# Altium schematic sheet CAN.SchDoc: =DocumentName
size A4; Organization: Queen's Formula SAE; Address1: 130 Stuart St, Kingston; Address2: Ontario; Address3: Canada; Address4: K7L 2V9; DocumentNumber: 1; Revision: 0; SheetNumber: 1; SheetTotal: 1
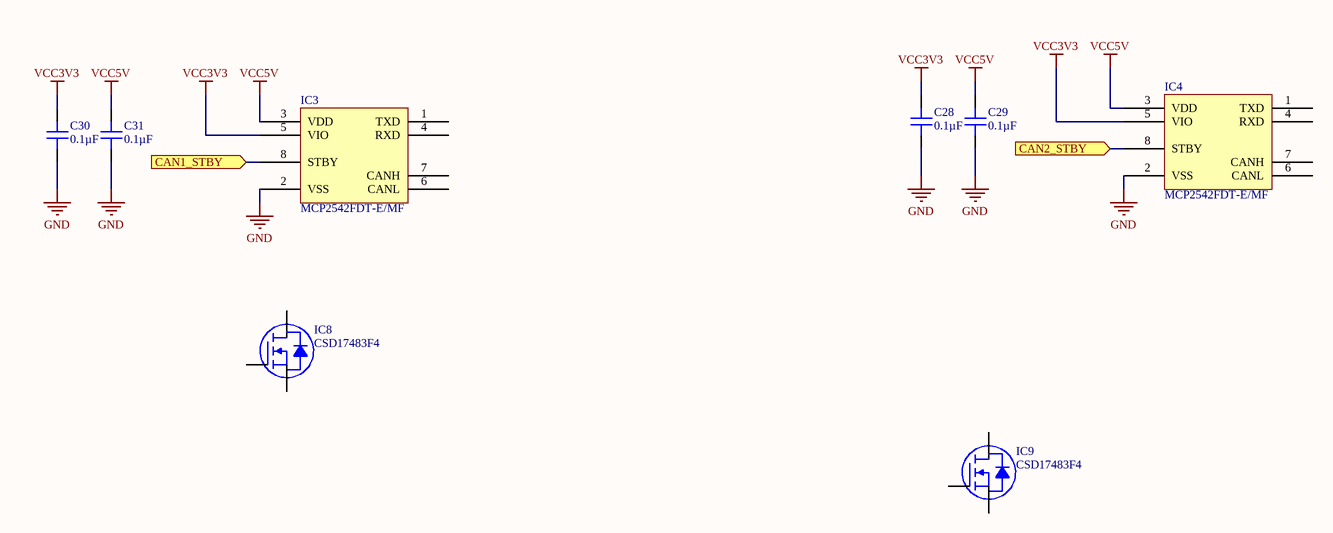
[diagram p0: CAN.SchDoc]

## Parts
C28  0.1µF  [CAP 0201_0603]
C29  0.1µF  [CAP 0201_0603]
C30  0.1µF  [CAP 0201_0603]
C31  0.1µF  [CAP 0201_0603]
IC3  MCP2542FDT-E/MF  [MICROCHIP DFN-8 3X3MM]
IC4  MCP2542FDT-E/MF  [MICROCHIP DFN-8 3X3MM]
IC8  CSD17483F4  [TI 3-XFDFN F4 YJC]
IC9  CSD17483F4  [TI 3-XFDFN F4 YJC]

## Ports
CAN1_STBY (in), CAN2_STBY (in)

## Nets
GND: C28.1 C29.1 C30.1 C31.1 IC3.2(VSS) IC4.2(VSS)
VCC3V3: C28.2 C30.2 IC3.5(VIO) IC4.5(VIO)
VCC5V: C29.2 C31.2 IC3.3(VDD) IC4.3(VDD)
CAN1_STBY: IC3.8(STBY) ; port CAN1_STBY
CAN2_STBY: IC4.8(STBY) ; port CAN2_STBY

Not connected (* = marked no-connect by the designer): IC3 1(TXD) 4(RXD) 6(CANL) 7(CANH); IC4 1(TXD) 4(RXD) 6(CANL) 7(CANH); IC8 D G S; IC9 D G S

## Notes on the sheet
- Title
- Size:
- Date:
- A4
- Number:
- Time:
- Revision:
- Sheet
- of
- File:

## Library data of the parts
C28-C31 = EMK063BJ104KP-F: CAP CER 0.1UF 16V X5R 0201; Manufacturer: Taiyo Yuden; Tolerance: ±10%; Part Number: EMK063BJ104KP-F; Value: 0.1µF; Applications: General Purpose; Capacitance: 0.1µF; ComponentLink1Description: Datasheet; ComponentLink1URL: https://ds.yuden.co.jp/TYCOMPAS/ut/detail?pn=EMK063BJ104KP-F  &u=M; ComponentLink2Description: DigiKey Link; ComponentLink2URL: http://digikey.com/product-detail/en/taiyo-yuden/EMK063BJ104KP-F/587-5833-1-ND/7674954; Device Package: 0201 (0603 Metric); LastUpdated: 2020-09-02 1:00:18 AM; Lifecycle Status: Active; Minimum Order: 1; Mounting Type: Surface Mount, MLCC; Operating Temperature: -55°C ~ 85°C; Package / Case: 0201 (0603 Metric); Packaging: TapeAndReel; PartId: 12; Part Status: Active; Price: 0.02; Series: M; Size / Dimension: 0.024" L x 0.012" W (0.60mm x 0.30mm); Supplier 1: DigiKey; Supplier Part Number 1: 587-5833-1-ND; Temperature Coefficient: X5R; Thickness (Max): 0.013" (0.33mm); Voltage - Rated: 16V
IC3 IC4 = MCP2542FDT-E/MF: IC TRANSCEIVER 1/1 8DFN; Manufacturer: Microchip Technology; Data Rate: 8Mbps; Protocol: CANbus; Receiver Hysteresis: 200mV; Voltage - Supply: 4.5V ~ 5.5V; Part Number: MCP2542FDT-E/MF; ComponentLink1Description: Datasheet; ComponentLink1URL: http://www.microchip.com/mymicrochip/filehandler.aspx?ddocname=en585412; ComponentLink2Description: DigiKey Link; ComponentLink2URL: http://digikey.com/product-detail/en/microchip-technology/MCP2542FDT-E-MF/MCP2542FDT-E-MFCT-ND/5975779; Device Package: 8-VDFN Exposed Pad; LastUpdated: 2020-05-24 11:09:12 PM; Lifecycle Status: Active; Minimum Order: 1; Mounting Type: Surface Mount; Number of Drivers/Receivers: 1/1; Operating Temperature: -40°C ~ 125°C; Package / Case: 8-VDFN Exposed Pad; Packaging: TapeAndReel; Part Status: Active; Price: 0.62; Series: -; Supplier 1: DigiKey; Supplier Part Number 1: MCP2542FDT-E/MFCT-ND; Supplier Device Package: 8-DFN (3x3); Type: Transceiver
IC8 IC9 = CSD17483F4: MOSFET N-CH 30V 1.5A 3PICOSTAR; Manufacturer: Texas Instruments; Current - Continuous Drain (Id) @ 25°C: 1.5A (Ta); Drive Voltage (Max Rds On,  Min Rds On): 1.8V, 4.5V; FET Type: N-Channel; Gate Charge (Qg) (Max) @ Vgs: 1.3nC @ 4.5V; Input Capacitance (Ciss) (Max) @ Vds: 190pF @ 15V; Power Dissipation (Max): 500mW (Ta); Rds On (Max) @ Id, Vgs: 240mOhm @ 500mA, 8V; Vgs (Max): 12V; Vgs(th) (Max) @ Id: 1.1V @ 250µA; Part Number: CSD17483F4; ComponentLink1Description: Datasheet; ComponentLink1URL: http://www.ti.com/general/docs/suppproductinfo.tsp?distId=10&gotoUrl=http%3A%2F%2Fwww.ti.com%2Flit%2Fgpn%2Fcsd17483f4; ComponentLink2Description: DigiKey Link; ComponentLink2URL: http://digikey.com/product-detail/en/texas-instruments/CSD17483F4/296-38914-1-ND/5143020; Drain to Source Voltage (Vdss): 30V; LastUpdated: 2020-09-02 1:30:14 AM; Lifecycle Status: Active; Minimum Order: 1; Mounting Type: Surface Mount; Operating Temperature: -55°C ~ 150°C (TJ); Package / Case: 3-XFDFN; Packaging: TapeAndReel; Part Status: Active; Price: 0.07; Series: NexFET™; Supplier 1: DigiKey; Supplier Part Number 1: 296-38914-1-ND; Supplier Device Package: 3-PICOSTAR; Technology: MOSFET (Metal Oxide)